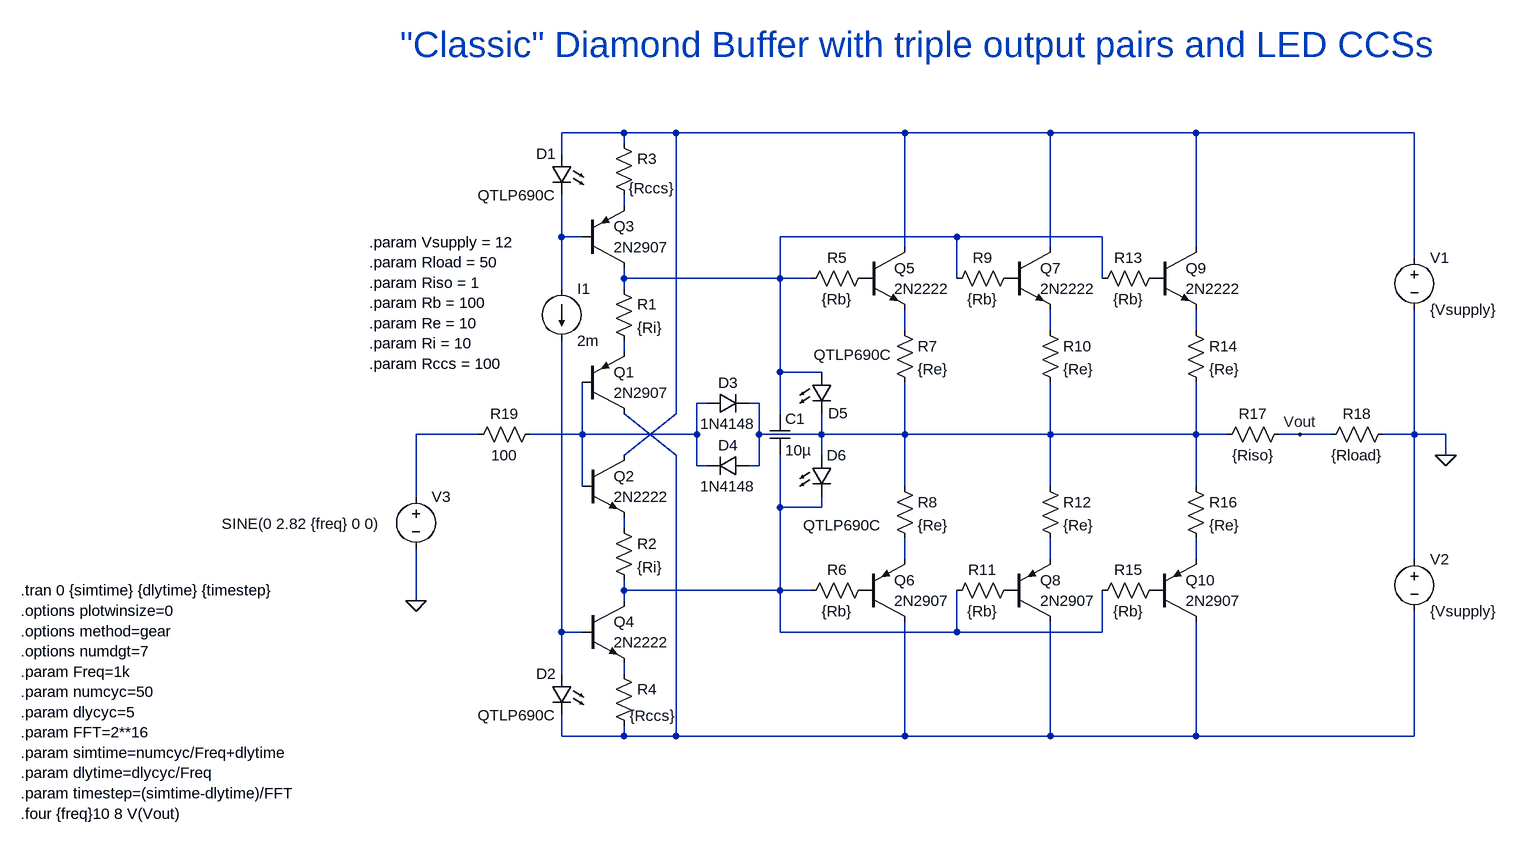
[diagram p0: schematic DDB_classic_triple.asc]
DDB_classic_triple.asc, the LTspice schematic file:
Version 4
SHEET 1 2152 880
WIRE 256 -80 160 -80
WIRE 336 -80 256 -80
WIRE 688 -80 336 -80
WIRE 912 -80 688 -80
WIRE 1136 -80 912 -80
WIRE 1472 -80 1136 -80
WIRE 256 -64 256 -80
WIRE 160 -48 160 -80
WIRE 256 32 256 16
WIRE 160 80 160 16
WIRE 192 80 160 80
WIRE 768 80 496 80
WIRE 992 80 768 80
WIRE 688 96 688 -80
WIRE 912 96 912 -80
WIRE 1136 96 1136 -80
WIRE 1472 112 1472 -80
WIRE 256 144 256 128
WIRE 496 144 496 80
WIRE 496 144 256 144
WIRE 544 144 496 144
WIRE 768 144 768 80
WIRE 992 144 992 80
WIRE 160 160 160 80
WIRE 256 160 256 144
WIRE 688 224 688 192
WIRE 912 224 912 192
WIRE 1136 224 1136 192
WIRE 256 256 256 240
WIRE 496 288 496 144
WIRE 560 288 496 288
WIRE 384 336 368 336
WIRE 464 336 448 336
WIRE 336 352 336 -80
WIRE 496 352 496 288
WIRE 32 384 -64 384
WIRE 192 384 192 304
WIRE 192 384 112 384
WIRE 368 384 368 336
WIRE 368 384 192 384
WIRE 464 384 464 336
WIRE 560 384 560 352
WIRE 560 384 464 384
WIRE 688 384 688 304
WIRE 688 384 560 384
WIRE 912 384 912 304
WIRE 912 384 688 384
WIRE 1136 384 1136 304
WIRE 1136 384 912 384
WIRE 1184 384 1136 384
WIRE 1296 384 1264 384
WIRE 1344 384 1296 384
WIRE 1472 384 1472 192
WIRE 1472 384 1424 384
WIRE 1520 384 1472 384
WIRE 256 416 336 352
WIRE 336 416 256 352
WIRE 560 416 560 384
WIRE 1520 416 1520 384
WIRE 368 432 368 384
WIRE 384 432 368 432
WIRE 464 432 464 384
WIRE 464 432 448 432
WIRE 192 464 192 384
WIRE 688 464 688 384
WIRE 912 464 912 384
WIRE 1136 464 1136 384
WIRE -64 480 -64 384
WIRE 496 496 496 416
WIRE 560 496 560 480
WIRE 560 496 496 496
WIRE 256 528 256 512
WIRE 688 576 688 544
WIRE 912 576 912 544
WIRE 1136 576 1136 544
WIRE 1472 576 1472 384
WIRE 256 624 256 608
WIRE 496 624 496 496
WIRE 496 624 256 624
WIRE 544 624 496 624
WIRE -64 640 -64 560
WIRE 256 640 256 624
WIRE 160 688 160 240
WIRE 192 688 160 688
WIRE 496 688 496 624
WIRE 768 688 768 624
WIRE 768 688 496 688
WIRE 992 688 992 624
WIRE 992 688 768 688
WIRE 160 752 160 688
WIRE 256 752 256 736
WIRE 160 848 160 816
WIRE 256 848 256 832
WIRE 256 848 160 848
WIRE 336 848 336 416
WIRE 336 848 256 848
WIRE 688 848 688 672
WIRE 688 848 336 848
WIRE 912 848 912 672
WIRE 912 848 688 848
WIRE 1136 848 1136 672
WIRE 1136 848 912 848
WIRE 1472 848 1472 656
WIRE 1472 848 1136 848
FLAG -64 640 0
FLAG 1520 416 0
FLAG 1296 384 Vout
SYMBOL npn 192 416 R0
WINDOW 0 48 32 Left 2
WINDOW 3 48 64 Left 2
SYMATTR InstName Q2
SYMATTR Value 2N2222
SYMBOL pnp 192 352 M180
WINDOW 0 48 64 Left 2
WINDOW 3 48 32 Left 2
SYMATTR InstName Q1
SYMATTR Value 2N2907
SYMBOL res 240 144 R0
SYMATTR InstName R1
SYMATTR Value {Ri}
SYMBOL res 240 512 R0
SYMATTR InstName R2
SYMATTR Value {Ri}
SYMBOL pnp 192 128 M180
WINDOW 0 48 64 Left 2
WINDOW 3 48 32 Left 2
SYMATTR InstName Q3
SYMATTR Value 2N2907
SYMBOL npn 192 640 R0
WINDOW 0 48 32 Left 2
WINDOW 3 48 64 Left 2
SYMATTR InstName Q4
SYMATTR Value 2N2222
SYMBOL res 240 -80 R0
WINDOW 3 23 85 Left 2
SYMATTR InstName R3
SYMATTR Value {Rccs}
SYMBOL res 240 736 R0
WINDOW 3 25 81 Left 2
SYMATTR InstName R4
SYMATTR Value {Rccs}
SYMBOL LED 176 -48 M0
SYMATTR InstName D1
SYMATTR Value QTLP690C
SYMBOL LED 176 752 M0
SYMATTR InstName D2
SYMATTR Value QTLP690C
SYMBOL cap 480 352 R0
SYMATTR InstName C1
SYMATTR Value 10µ
SYMBOL npn 624 96 R0
WINDOW 0 48 32 Left 2
WINDOW 3 48 64 Left 2
SYMATTR InstName Q5
SYMATTR Value 2N2222
SYMBOL pnp 624 672 M180
WINDOW 0 48 64 Left 2
WINDOW 3 48 32 Left 2
SYMATTR InstName Q6
SYMATTR Value 2N2907
SYMBOL res 640 128 R90
WINDOW 0 0 56 VBottom 2
WINDOW 3 32 56 VTop 2
SYMATTR InstName R5
SYMATTR Value {Rb}
SYMBOL res 640 608 R90
WINDOW 0 0 56 VBottom 2
WINDOW 3 32 56 VTop 2
SYMATTR InstName R6
SYMATTR Value {Rb}
SYMBOL res 672 208 R0
SYMATTR InstName R7
SYMATTR Value {Re}
SYMBOL res 672 448 R0
SYMATTR InstName R8
SYMATTR Value {Re}
SYMBOL npn 848 96 R0
WINDOW 0 48 32 Left 2
WINDOW 3 48 64 Left 2
SYMATTR InstName Q7
SYMATTR Value 2N2222
SYMBOL res 864 128 R90
WINDOW 0 0 56 VBottom 2
WINDOW 3 32 56 VTop 2
SYMATTR InstName R9
SYMATTR Value {Rb}
SYMBOL res 896 208 R0
SYMATTR InstName R10
SYMATTR Value {Re}
SYMBOL pnp 848 672 M180
WINDOW 0 48 64 Left 2
WINDOW 3 48 32 Left 2
SYMATTR InstName Q8
SYMATTR Value 2N2907
SYMBOL res 864 608 R90
WINDOW 0 0 56 VBottom 2
WINDOW 3 32 56 VTop 2
SYMATTR InstName R11
SYMATTR Value {Rb}
SYMBOL res 896 448 R0
SYMATTR InstName R12
SYMATTR Value {Re}
SYMBOL npn 1072 96 R0
WINDOW 0 48 32 Left 2
WINDOW 3 48 64 Left 2
SYMATTR InstName Q9
SYMATTR Value 2N2222
SYMBOL res 1088 128 R90
WINDOW 0 0 56 VBottom 2
WINDOW 3 32 56 VTop 2
SYMATTR InstName R13
SYMATTR Value {Rb}
SYMBOL res 1120 208 R0
SYMATTR InstName R14
SYMATTR Value {Re}
SYMBOL pnp 1072 672 M180
WINDOW 0 48 64 Left 2
WINDOW 3 48 32 Left 2
SYMATTR InstName Q10
SYMATTR Value 2N2907
SYMBOL res 1088 608 R90
WINDOW 0 0 56 VBottom 2
WINDOW 3 32 56 VTop 2
SYMATTR InstName R15
SYMATTR Value {Rb}
SYMBOL res 1120 448 R0
SYMATTR InstName R16
SYMATTR Value {Re}
SYMBOL current 160 160 R0
SYMATTR InstName I1
SYMATTR Value 2m
SYMBOL diode 384 352 R270
WINDOW 0 32 32 VTop 2
WINDOW 3 0 32 VBottom 2
SYMATTR InstName D3
SYMATTR Value 1N4148
SYMBOL diode 448 416 R90
WINDOW 0 0 32 VBottom 2
WINDOW 3 32 32 VTop 2
SYMATTR InstName D4
SYMATTR Value 1N4148
SYMBOL LED 544 288 R0
WINDOW 0 26 63 Left 2
WINDOW 3 4 -27 Left 2
SYMATTR InstName D5
SYMATTR Value QTLP690C
SYMBOL LED 544 416 R0
WINDOW 3 -12 108 Left 2
SYMATTR InstName D6
SYMATTR Value QTLP690C
SYMBOL res 1280 368 R90
WINDOW 0 0 56 VBottom 2
WINDOW 3 32 56 VTop 2
SYMATTR InstName R17
SYMATTR Value {Riso}
SYMBOL res 1440 368 R90
WINDOW 0 0 56 VBottom 2
WINDOW 3 32 56 VTop 2
SYMATTR InstName R18
SYMATTR Value {Rload}
SYMBOL voltage 1472 96 R0
SYMATTR InstName V1
SYMATTR Value {Vsupply}
SYMBOL voltage 1472 560 R0
SYMATTR InstName V2
SYMATTR Value {Vsupply}
SYMBOL res 128 368 R90
WINDOW 0 0 56 VBottom 2
WINDOW 3 32 56 VTop 2
SYMATTR InstName R19
SYMATTR Value 100
SYMBOL voltage -64 464 R0
WINDOW 3 -299 57 Left 2
SYMATTR InstName V3
SYMATTR Value SINE(0 2.82 {freq} 0 0)
TEXT -136 88 Left 2 !.param Vsupply = 12\n.param Rload = 50\n.param Riso = 1\n.param Rb = 100\n.param Re = 10\n.param Ri = 10\n.param Rccs = 100
TEXT -672 624 Left 2 !.tran 0 {simtime} {dlytime} {timestep}\n.options plotwinsize=0\n.options method=gear\n.options numdgt=7\n.param Freq=1k\n.param numcyc=50\n.param dlycyc=5\n.param FFT=2**16\n.param simtime=numcyc/Freq+dlytime\n.param dlytime=dlycyc/Freq\n.param timestep=(simtime-dlytime)/FFT\n.four {freq}10 8 V(Vout)
TEXT -88 -216 Left 5 ;"Classic" Diamond Buffer with triple output pairs and LED CCSs

The netlist it stands for:
* DDB_classic_triple.asc
Q2 N001 N009 N014 0 2N2222
Q1 N012 N009 N008 0 2N2907
R1 N004 N008 {Ri}
R2 N014 N013 {Ri}
Q3 N004 N003 N002 0 2N2907
Q4 N013 N018 N019 0 2N2222
R3 N001 N002 {Rccs}
R4 N019 N012 {Rccs}
D1 N001 N003 QTLP690C
D2 N018 N012 QTLP690C
C1 N004 N013 10µ
Q5 N001 P001 N005 0 2N2222
Q6 N012 P002 N015 0 2N2907
R5 P001 N004 {Rb}
R6 P002 N013 {Rb}
R7 N005 N010 {Re}
R8 N010 N015 {Re}
Q7 N001 P003 N006 0 2N2222
R9 P003 N004 {Rb}
R10 N006 N010 {Re}
Q8 N012 P004 N016 0 2N2907
R11 P004 N013 {Rb}
R12 N010 N016 {Re}
Q9 N001 P005 N007 0 2N2222
R13 P005 N004 {Rb}
R14 N007 N010 {Re}
Q10 N012 P006 N017 0 2N2907
R15 P006 N013 {Rb}
R16 N010 N017 {Re}
I1 N003 N018 2m
D3 N009 N010 1N4148
D4 N010 N009 1N4148
D5 N004 N010 QTLP690C
D6 N010 N013 QTLP690C
R17 Vout N010 {Riso}
R18 0 Vout {Rload}
V1 N001 0 {Vsupply}
V2 0 N012 {Vsupply}
R19 N009 N011 100
V3 N011 0 SINE(0 2.82 {freq} 0 0)
.model D D
.lib standard.dio
.model NPN NPN
.model PNP PNP
.lib standard.bjt
.param Vsupply = 12
.param Rload = 50
.param Riso = 1
.param Rb = 100
.param Re = 10
.param Ri = 10
.param Rccs = 100
.tran 0 {simtime} {dlytime} {timestep}
.options plotwinsize=0
.options method=gear
.options numdgt=7
.param Freq=1k
.param numcyc=50
.param dlycyc=5
.param FFT=2**16
.param simtime=numcyc/Freq+dlytime
.param dlytime=dlycyc/Freq
.param timestep=(simtime-dlytime)/FFT
.four {freq}10 8 V(Vout)
* "Classic" Diamond Buffer with triple output pairs and LED CCSs
.backanno
.end